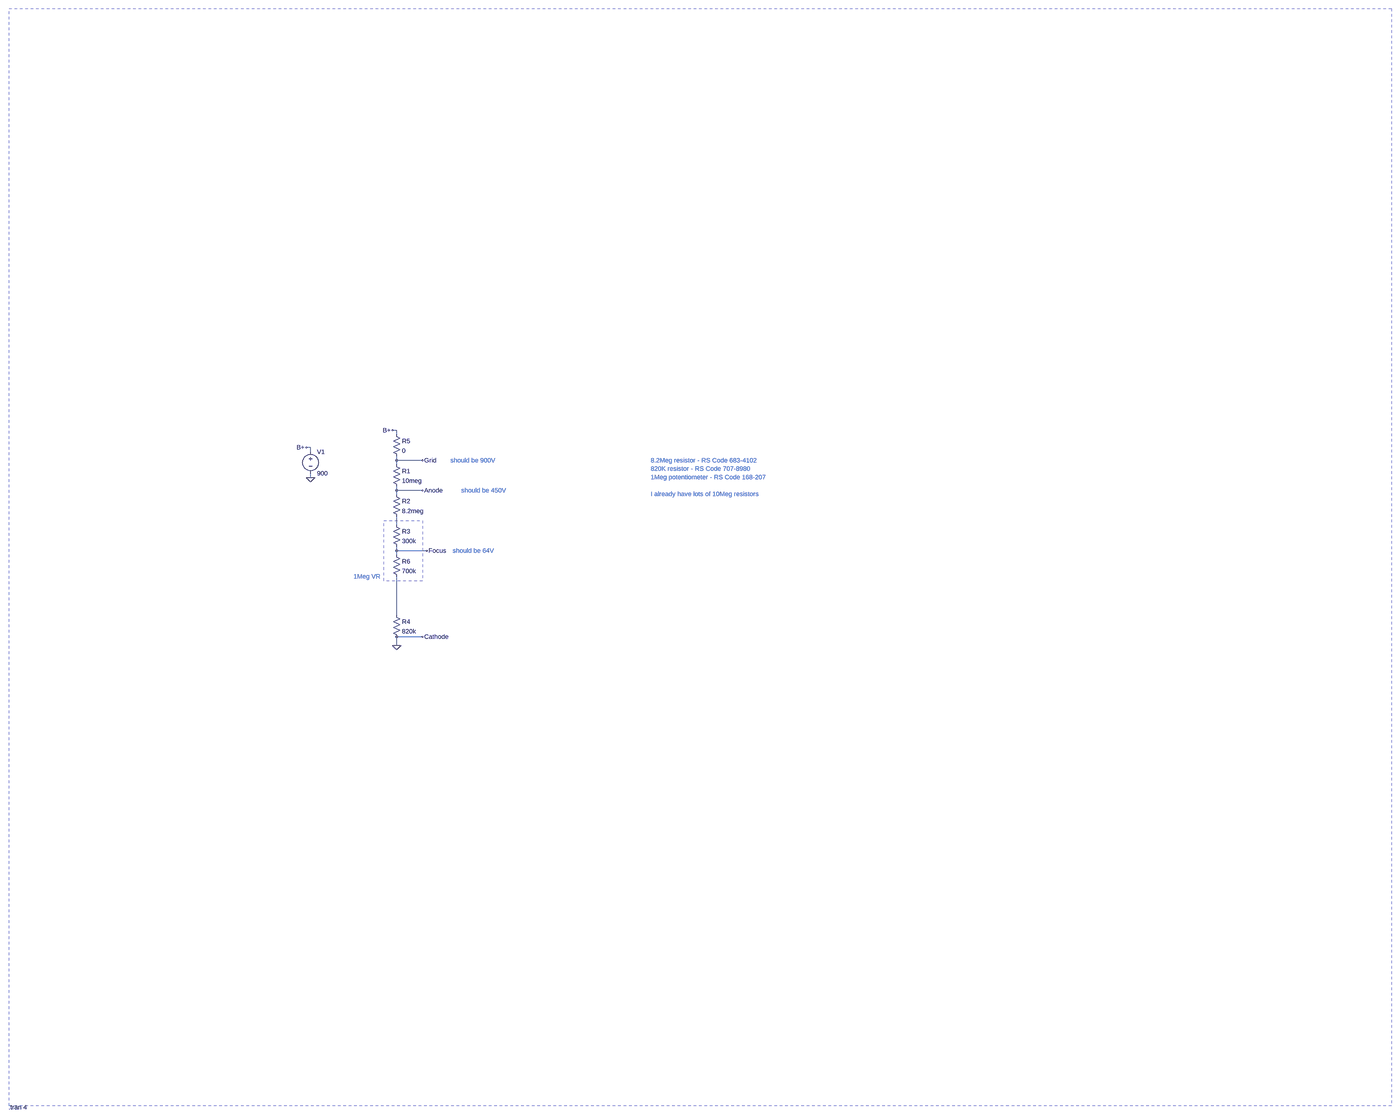
[diagram p0: schematic VoltageDivider.asc, whole sheet]
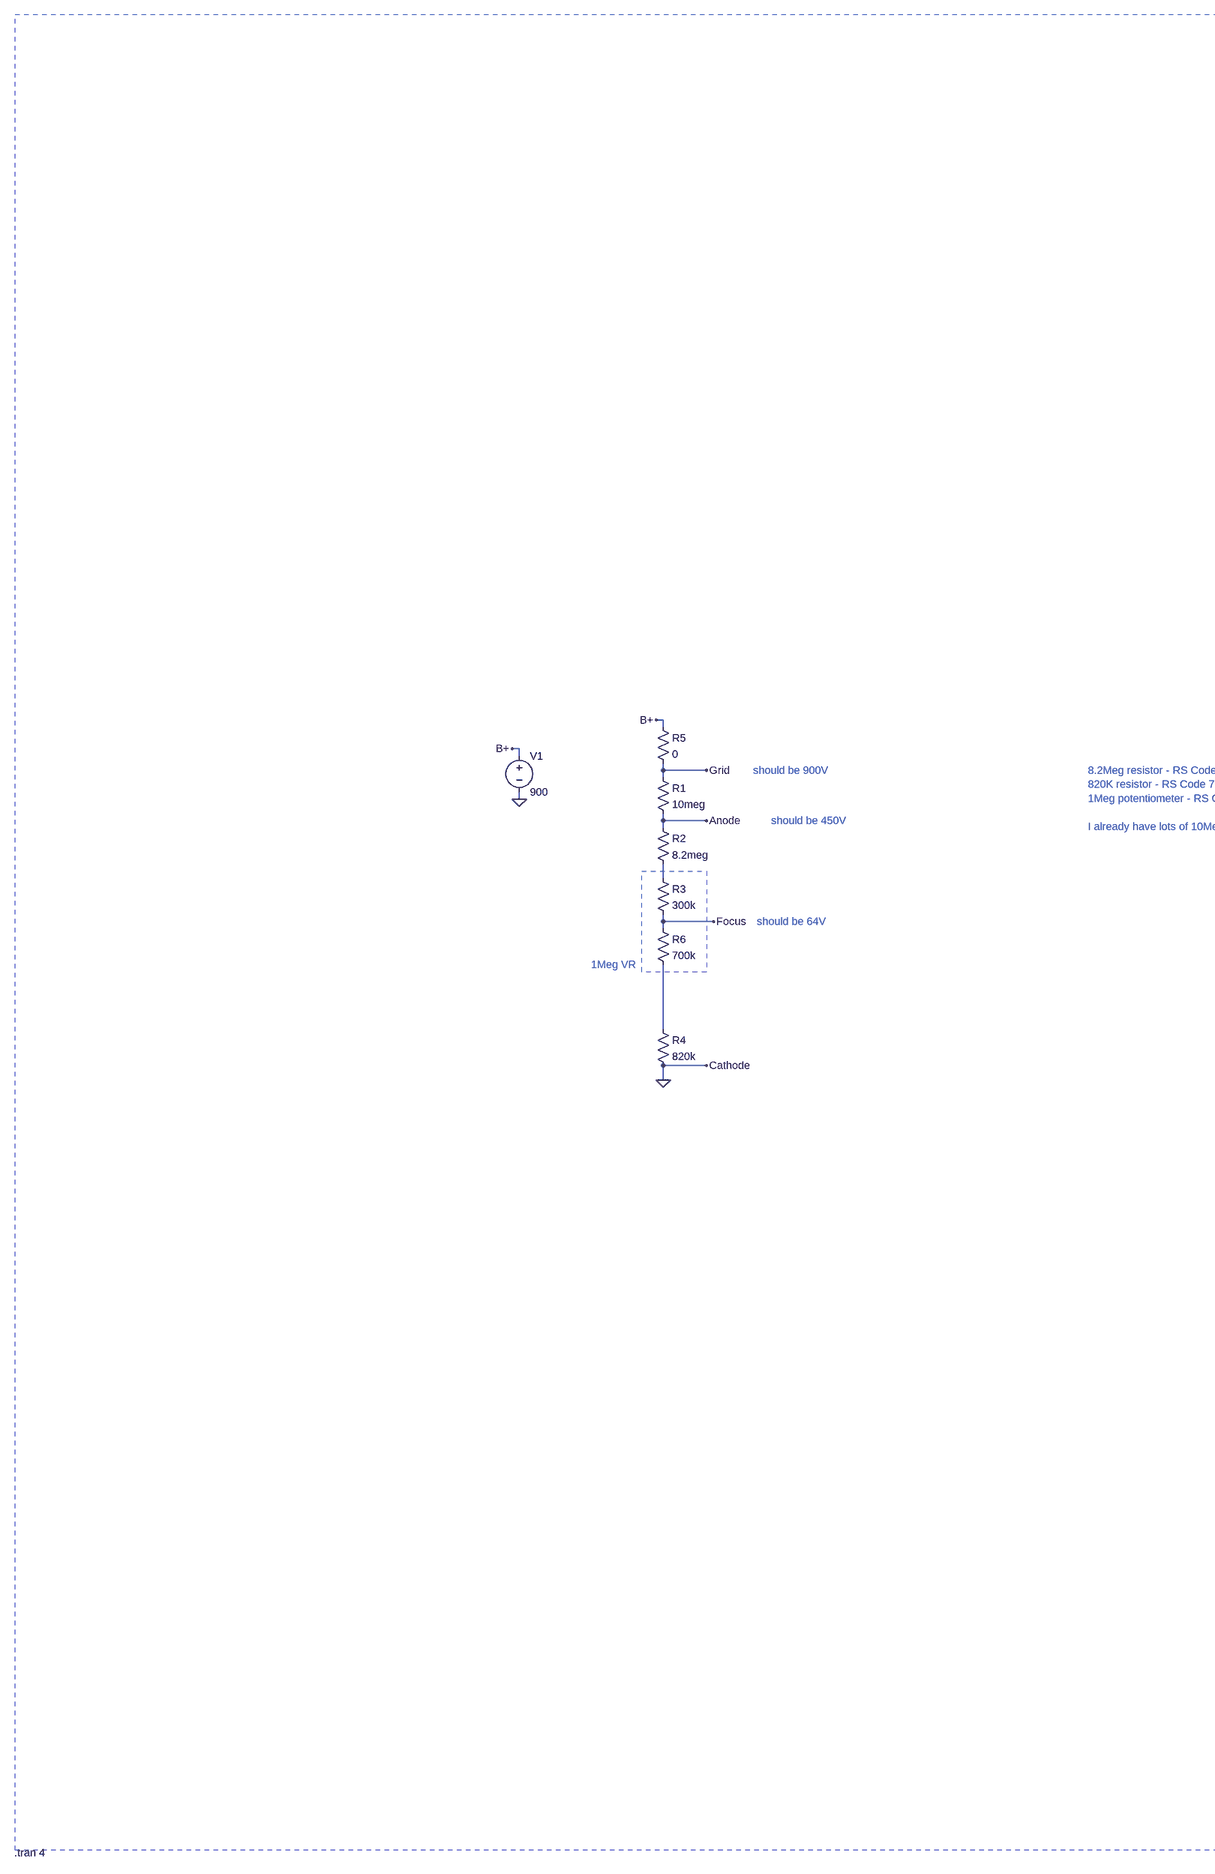
[diagram p1: schematic VoltageDivider.asc, part, row 1 of 1, column 1 of 2]
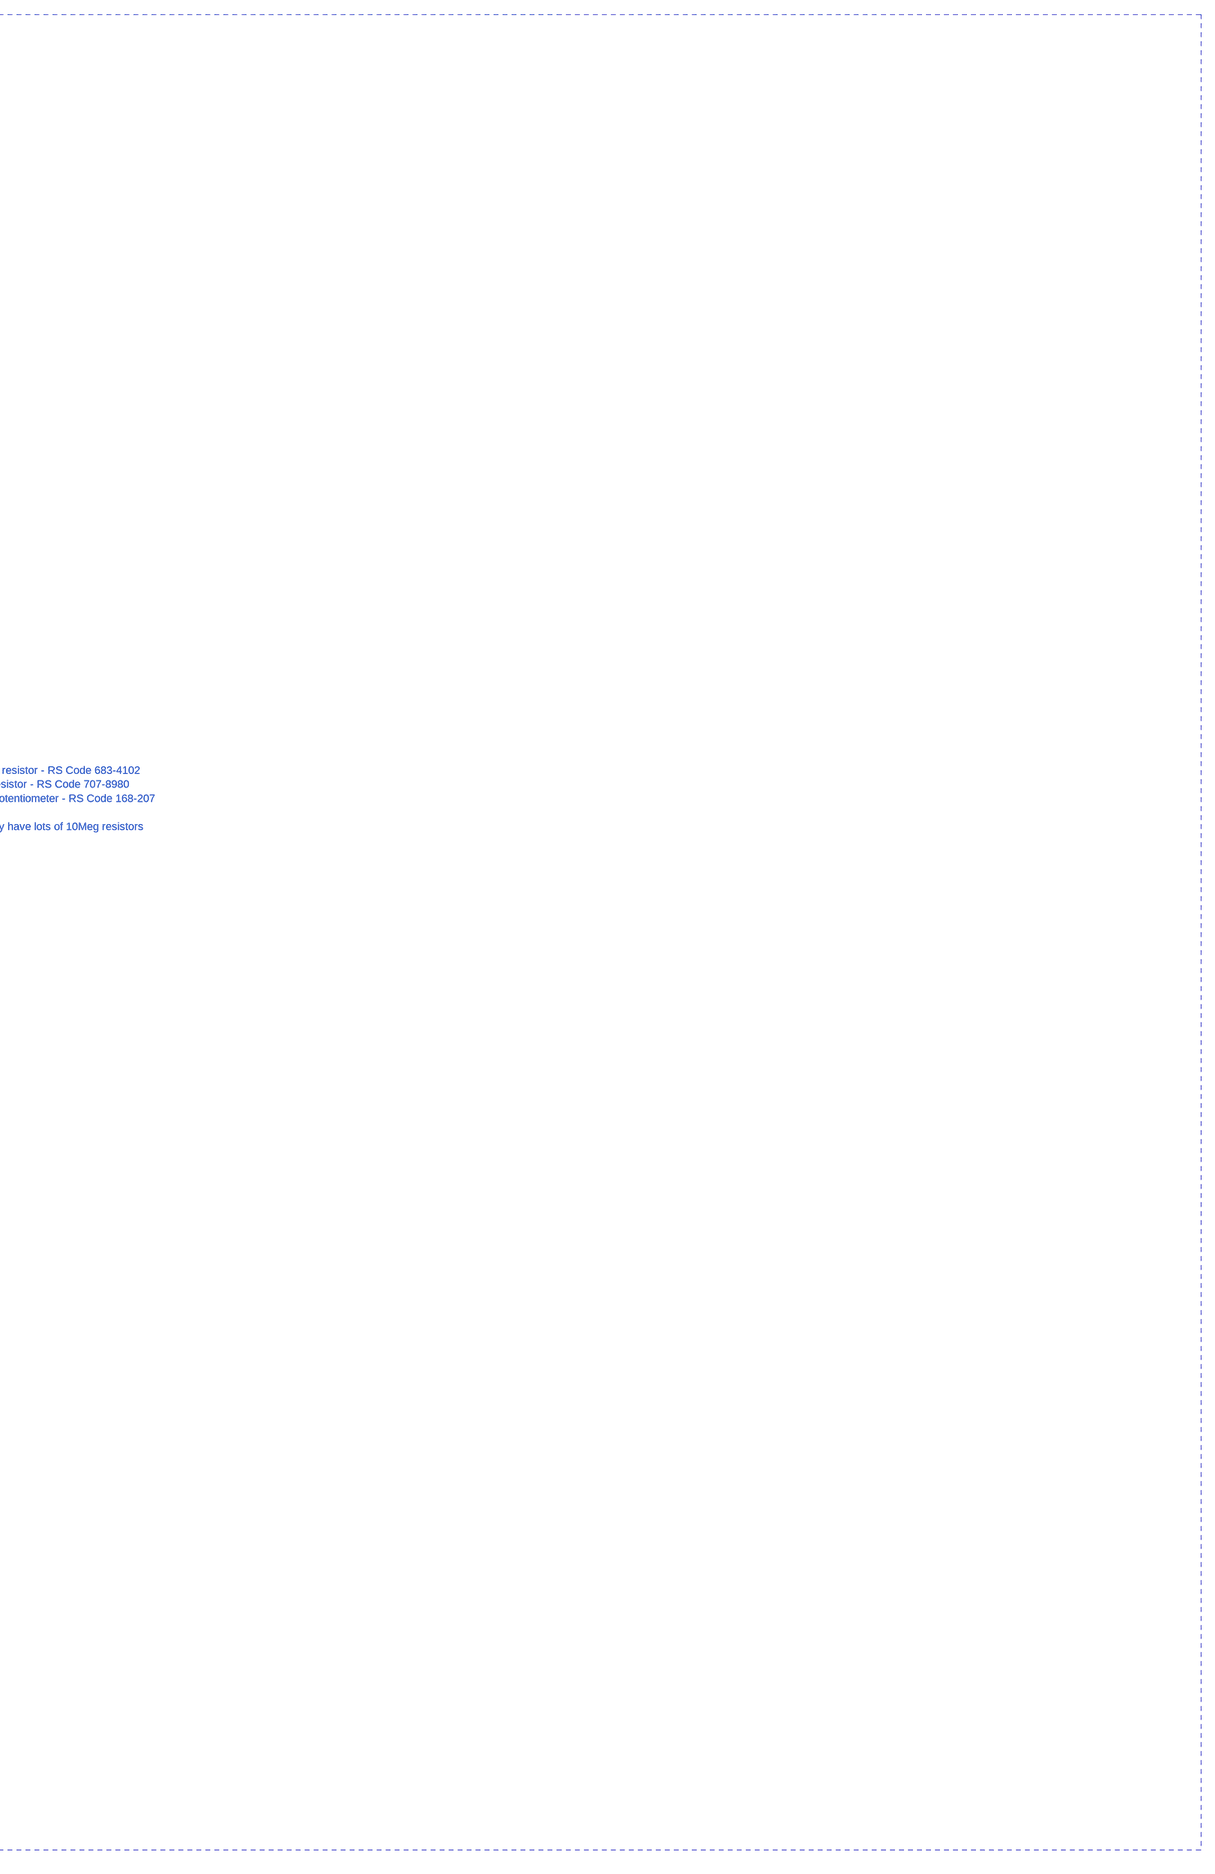
[diagram p2: schematic VoltageDivider.asc, part, row 1 of 1, column 2 of 2]
VoltageDivider.asc, the LTspice schematic file:
Version 4
SHEET 1 3668 2440
WIRE -32 -96 -48 -96
WIRE -32 -80 -32 -96
WIRE -352 -32 -368 -32
WIRE -352 -16 -352 -32
WIRE -32 16 -32 0
WIRE 64 16 -32 16
WIRE -32 32 -32 16
WIRE -352 80 -352 64
WIRE -32 128 -32 112
WIRE 64 128 -32 128
WIRE -32 144 -32 128
WIRE -32 256 -32 224
WIRE -32 352 -32 336
WIRE 80 352 -32 352
WIRE -32 368 -32 352
WIRE -32 592 -32 448
WIRE 64 672 -32 672
WIRE -32 704 -32 672
FLAG -32 704 0
FLAG -368 -32 B+
FLAG -352 80 0
FLAG -48 -96 B+
FLAG 64 16 Grid
FLAG 64 672 Cathode
FLAG 64 128 Anode
FLAG 80 352 Focus
SYMBOL res -48 16 R0
SYMATTR InstName R1
SYMATTR Value 10meg
SYMBOL res -48 128 R0
SYMATTR InstName R2
SYMATTR Value 8.2meg
SYMBOL res -48 240 R0
SYMATTR InstName R3
SYMATTR Value 300k
SYMBOL res -48 -96 R0
SYMATTR InstName R5
SYMATTR Value 0
SYMBOL voltage -352 -32 R0
WINDOW 123 0 0 Left 2
WINDOW 39 0 0 Left 2
SYMATTR InstName V1
SYMATTR Value 900
SYMBOL res -48 576 R0
SYMATTR InstName R4
SYMATTR Value 820k
SYMBOL res -48 352 R0
SYMATTR InstName R6
SYMATTR Value 700k
TEXT -1474 2422 Left 2 !.tran 4
TEXT 168 16 Left 2 ;should be 900V
TEXT 208 128 Left 2 ;should be 450V
TEXT 176 352 Left 2 ;should be 64V
TEXT -192 448 Left 2 ;1Meg VR
TEXT 912 16 Left 2 ;8.2Meg resistor - RS Code 683-4102\n820K resistor - RS Code 707-8980\n1Meg potentiometer - RS Code 168-207\n \nI already have lots of 10Meg resistors
RECTANGLE Normal 3664 2416 -1472 -1664 2
RECTANGLE Normal 64 464 -80 240 2

The netlist it stands for:
* VoltageDivider.asc
R1 Grid Anode 10meg
R2 Anode N001 8.2meg
R3 N001 Focus 300k
R5 B+ Grid 0
V1 B+ 0 900
R4 N002 0 820k
R6 Focus N002 700k
.tran 4
* should be 900V
* should be 450V
* should be 64V
* 1Meg VR
* 8.2Meg resistor - RS Code 683-4102
* 820K resistor - RS Code 707-8980
* 1Meg potentiometer - RS Code 168-207
* I already have lots of 10Meg resistors
.backanno
.end